# EAGLE design n64_breakout (EAGLE 6.5.0)
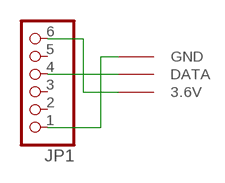
[diagram p0: schematic, sheet 1]

## Parts
JP1  PINHD-1X6  [1X06]
U$3  N64CONN  [N64CONN]

## Nets
3.3V: JP1.6 U$3.3.6V
DATA: JP1.4 U$3.DATA
GND: JP1.1 U$3.GND
Unconnected: JP1.2 JP1.3 JP1.5

## Library data of the parts
JP1 = pinhead:PINHD-1X6: PIN HEADER
U$3 = gamepad-conn:N64CONN

## Board
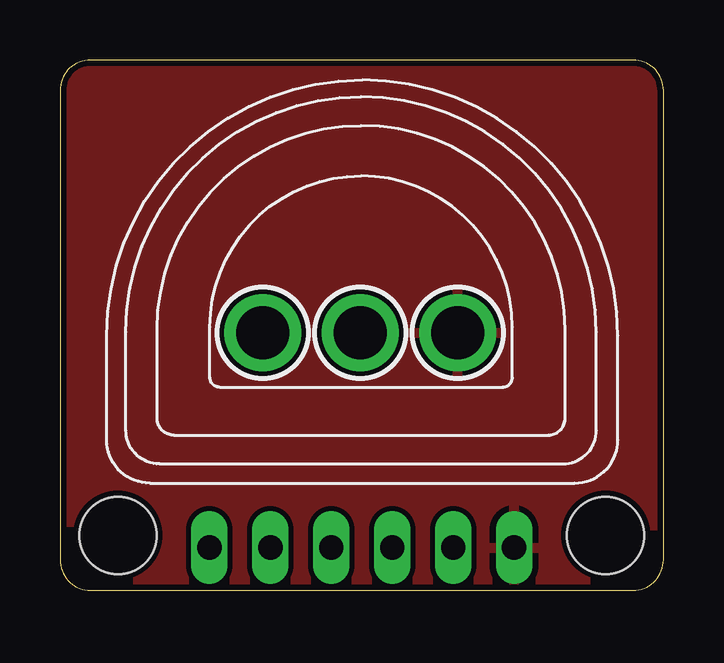
[diagram p1: board, top side]
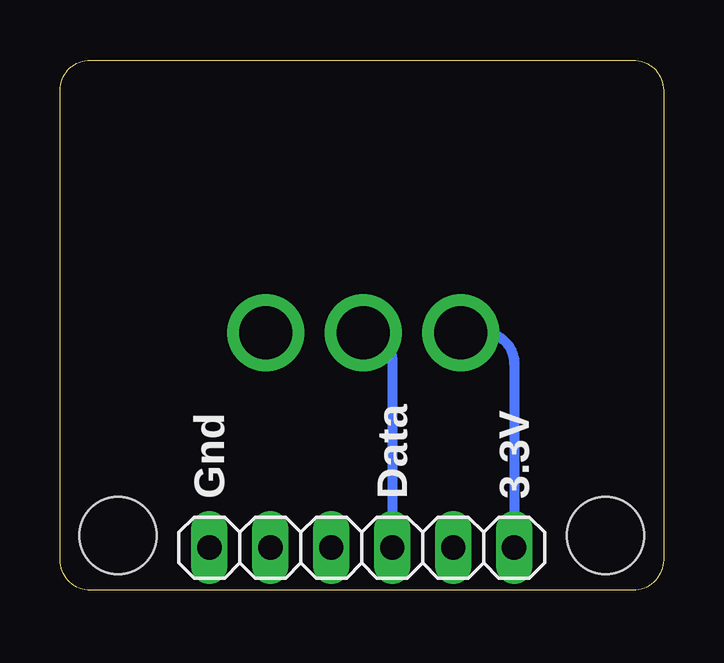
[diagram p2: board, bottom side, seen from below]

Size 25.15 x 22.1 mm. Coordinates in mm from the lower left corner, seen from the top.
Outline: 25.15,1.27 25.15,20.83 arc90 23.88,22.1 1.27,22.1 arc90 0,20.83 0,1.27 arc90 1.27,0 23.88,0 arc90 25.15,1.27
Copper layers (1*16): Top 0.035mm / dielectric 1.5mm / Bottom 0.035mm
Design rules "default *": minimum track width 10mil, minimum drill 24mil, track to track 8mil, track to pad 8mil, pad to pad 8mil, via to via 8mil, smd to smd 8mil, copper to edge 10mil, drill to drill 8mil, minimum pad ring 10mil, minimum via ring 8mil, stop-mask expansion 4mil, vias tented up to drill 0mil, thermal gap 10mil
Holes 3.2 mm at 2.41,2.29 22.73,2.29

### Footprints (pad centres in the part's own frame; a part is rotated, then mirrored left to right if it is on the bottom)
1X06 = drill 1.016 long: 1 -6.35,0; 2 -3.81,0; 3 -1.27,0; 4 1.27,0; 5 3.81,0; 6 6.35,0
N64CONN = drill 2.2 pad 3.1: 3.6V -4,0.064; DATA 0.064,0.064; GND 4.128,0.064

### Placement (x,y rotation side)
JP1  12.57,1.78 0 bottom
U$3  12.45,10.67 0 top

### Tracks (layer width: path | path; a pad name or v marks a point on that pad's centre or on a via)
3.3V
  Bottom 0.406: U$3.3.6V 7.49,10.73 arc90 6.22,9.46 JP1.6
DATA
  Bottom 0.406: U$3.DATA arc90 11.3,9.53 JP1.4
GND
  pour Top: -0.76,0 25.91,0 25.91,22.86 -0.76,22.86

### Text on the board
bNames: 3.3V | Data | Gnd